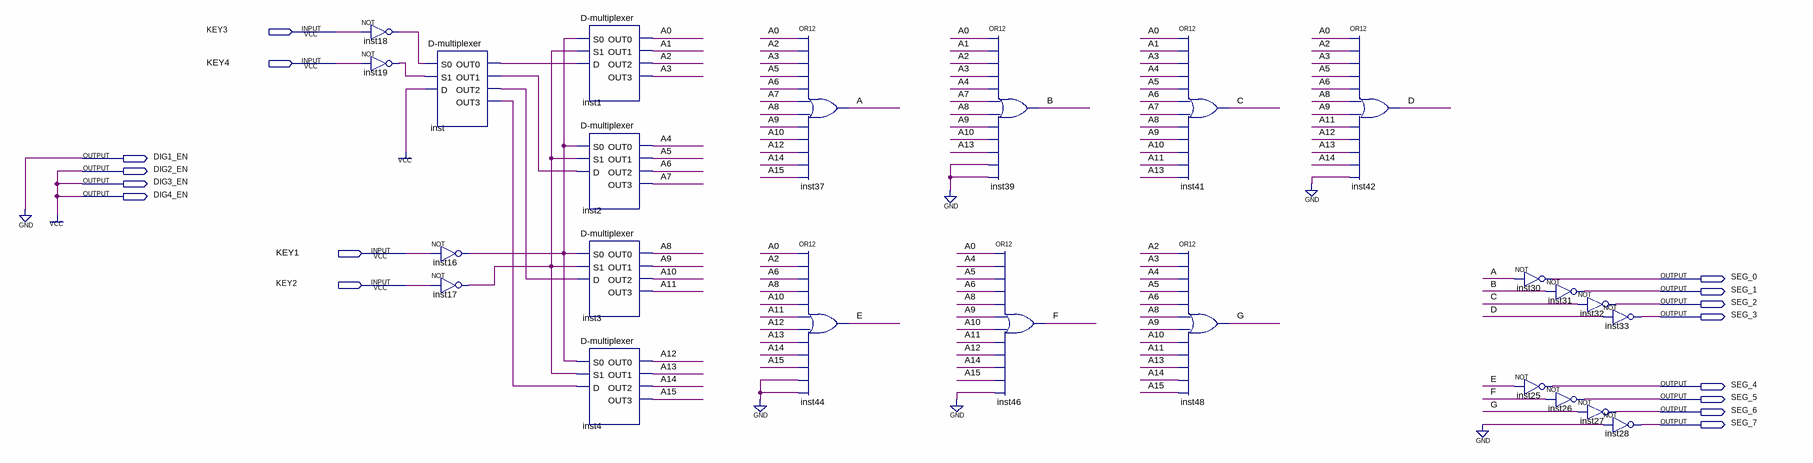
[diagram p0: schematic sheet]
// Quartus schematic Multiplexer.bdf as structural Verilog: 24 symbols, 16 pins
module Multiplexer (
  input  KEY3,
  input  KEY4,
  input  KEY1,
  input  KEY2,
  output DIG1_EN,
  output DIG2_EN,
  output DIG3_EN,
  output DIG4_EN,
  output SEG_0,
  output SEG_1,
  output SEG_2,
  output SEG_3,
  output SEG_4,
  output SEG_5,
  output SEG_6,
  output SEG_7
);

  wire A, A0, A1, A2, A3, A4, A5, A6, A7, A8, A9, A10, A11, A12, A13, A14, A15, B, C, D, E, F, G, inst16_out,
       inst17_out, inst18_out, inst19_out, inst_out0, inst_out1, inst_out2, inst_out3;

  not inst18 (inst18_out, KEY3);
  not inst19 (inst19_out, KEY4);
  \D-multiplexer  inst (
    .S0(inst18_out), .S1(inst19_out), .D(1'b1), .OUT0(inst_out0), .OUT1(inst_out1), .OUT2(inst_out2),
    .OUT3(inst_out3));
  not inst16 (inst16_out, KEY1);
  not inst17 (inst17_out, KEY2);
  \D-multiplexer  inst1 (.S0(inst16_out), .S1(inst17_out), .D(inst_out0), .OUT0(A0), .OUT1(A1), .OUT2(A2), .OUT3(A3));
  \D-multiplexer  inst2 (.S0(inst16_out), .S1(inst17_out), .D(inst_out1), .OUT0(A4), .OUT1(A5), .OUT2(A6), .OUT3(A7));
  \D-multiplexer  inst3 (.S0(inst16_out), .S1(inst17_out), .D(inst_out2), .OUT0(A8), .OUT1(A9), .OUT2(A10), .OUT3(A11));
  \D-multiplexer  inst4 (
    .S0(inst16_out), .S1(inst17_out), .D(inst_out3), .OUT0(A12), .OUT1(A13), .OUT2(A14), .OUT3(A15));
  or inst37 (A, A0, A2, A3, A5, A6, A7, A8, A9, A10, A12, A14, A15);
  or inst44 (E, A0, A2, A6, A8, A10, A11, A12, A13, A14, A15, 1'b0, 1'b0);
  or inst39 (B, A0, A1, A2, A3, A4, A7, A8, A9, A10, A13, 1'b0, 1'b0);
  or inst46 (F, A0, A4, A5, A6, A8, A9, A10, A11, A12, A14, A15, 1'b0);
  or inst41 (C, A0, A1, A3, A4, A5, A6, A7, A8, A9, A10, A11, A13);
  or inst48 (G, A2, A3, A4, A5, A6, A8, A9, A10, A11, A13, A14, A15);
  or inst42 (D, A0, A2, A3, A5, A6, A8, A9, A11, A12, A13, A14, 1'b0);
  not inst30 (SEG_0, A);
  not inst31 (SEG_1, B);
  not inst25 (SEG_4, E);
  not inst26 (SEG_5, F);
  not inst32 (SEG_2, C);
  not inst33 (SEG_3, D);
  not inst27 (SEG_6, G);
  not inst28 (SEG_7, 1'b0);

  assign DIG1_EN = 1'b0;
  assign DIG2_EN = 1'b1;
  assign DIG3_EN = 1'b1;
  assign DIG4_EN = 1'b1;
endmodule
